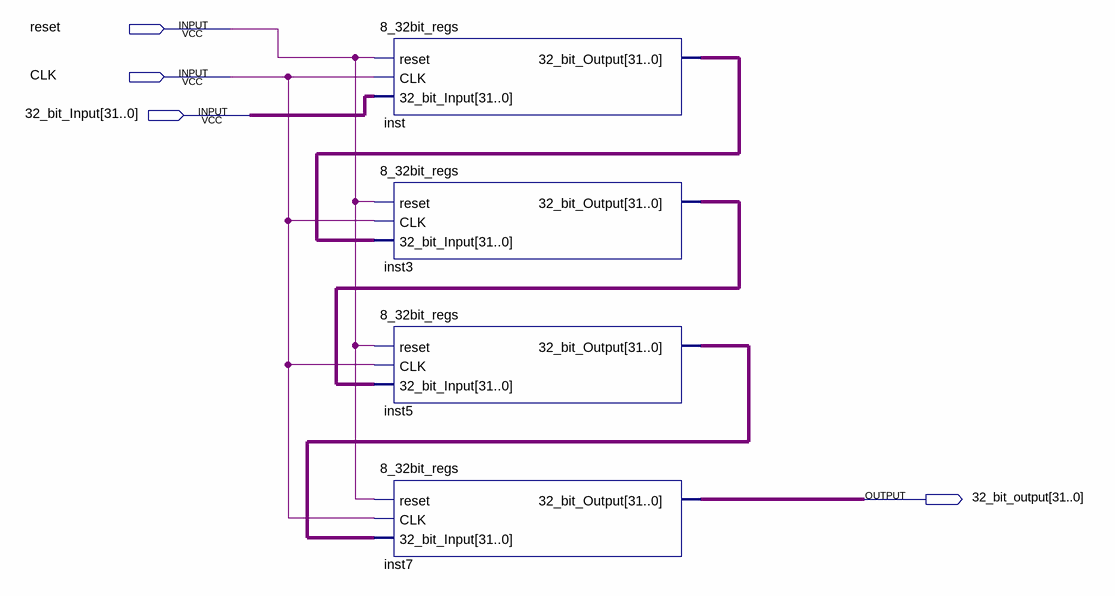
[diagram p0: schematic sheet]
// Quartus schematic 32_32bit_regs.bdf as structural Verilog: 4 symbols, 4 pins
module \32_32bit_regs  (
  input  reset,
  input  CLK,
  input  [31:0] \32_bit_Input ,
  output [31:0] \32_bit_output 
);

  wire [31:0] inst3_32_bit_output, inst5_32_bit_output, inst_32_bit_output;

  \8_32bit_regs  inst (.reset(reset), .CLK(CLK), .\32_bit_Input (\32_bit_Input ), .\32_bit_Output (inst_32_bit_output));
  \8_32bit_regs  inst3 (
    .reset(reset), .CLK(CLK), .\32_bit_Input (inst_32_bit_output), .\32_bit_Output (inst3_32_bit_output));
  \8_32bit_regs  inst5 (
    .reset(reset), .CLK(CLK), .\32_bit_Input (inst3_32_bit_output), .\32_bit_Output (inst5_32_bit_output));
  \8_32bit_regs  inst7 (
    .reset(reset), .CLK(CLK), .\32_bit_Input (inst5_32_bit_output), .\32_bit_Output (\32_bit_output ));
endmodule
